# EAGLE design serial (EAGLE 5.04)
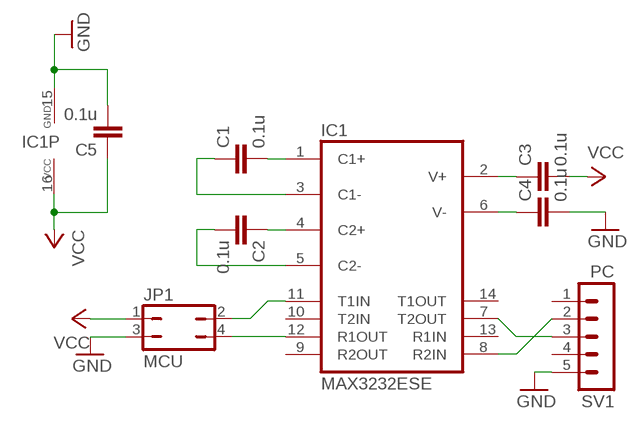
[diagram p0: schematic, sheet 1]

## Parts
C1  0.1u  C-EUC0805  [C0805]
C2  0.1u  C-EUC0805  [C0805]
C3  0.1u  C-EUC0805  [C0805]
C4  0.1u  C-EUC0805  [C0805]
C5  0.1u  C-EUC0805  [C0805]
IC1  MAX3232ESE  [SO16]
JP1  MCU  JP2Q  [JP2Q]
SV1  PC  MA05-1  [MA05-1]

## Nets
GND: C4.2 C5.2 IC1.15(GND) JP1.3 SV1.5
N$1: C1.2 IC1.1(C1+)
N$2: C2.1 IC1.4(C2+)
N$3: C3.1 IC1.2(V+)
N$4: C4.1 IC1.6(V-)
N$5: IC1.8(R2IN) SV1.2
N$6: C1.1 IC1.3(C1-)
N$7: C2.2 IC1.5(C2-)
N$8: IC1.7(T2OUT) SV1.3
N$9: IC1.12(R1OUT) JP1.4
N$10: IC1.11(T1IN) JP1.2
VCC: C3.2 C5.1 IC1.16(VCC) JP1.1
Unconnected: IC1.9(R2OUT) IC1.10(T2IN) IC1.13(R1IN) IC1.14(T1OUT) SV1.1 SV1.4

## Library data of the parts
C1-C5 = rcl:C-EU: CAPACITOR, European symbol
IC1 = maxim:MAX3232*: True RS-232 Transceivers 3.0V to 5.5V, Low-Power up to 1Mbps, Using Four 0.1µF External Capacitors Source: http://pdfserv.maxim-ic.com/en/ds/MAX3222-MAX3241.pdf
JP1 = jumper:JP2Q: JUMPER
SV1 = con-lstb:MA05-1: PIN HEADER

## Board
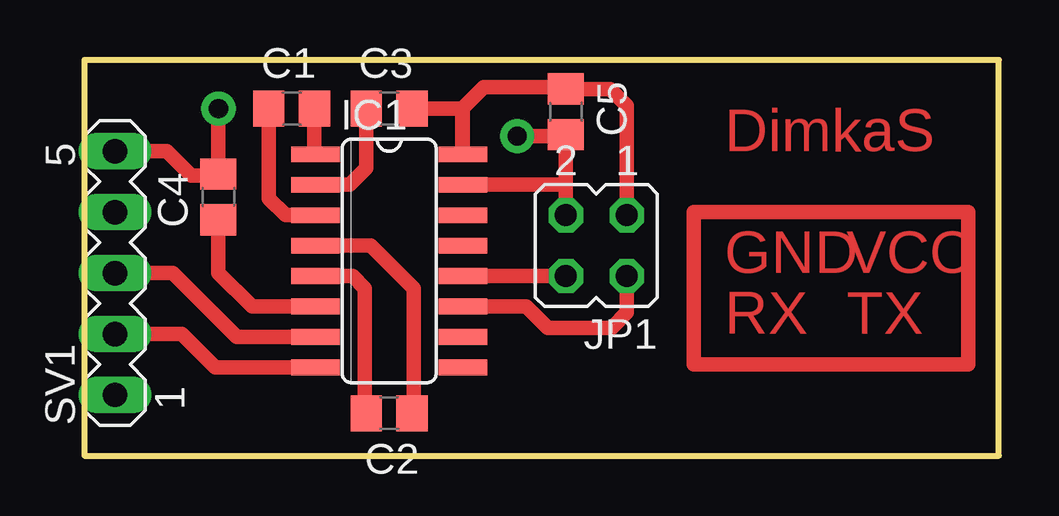
[diagram p1: board, top side]
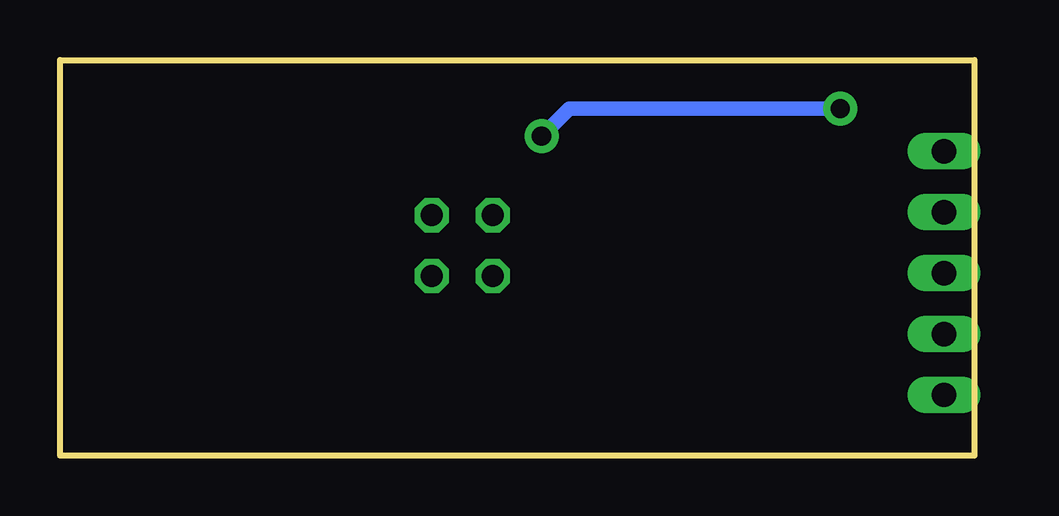
[diagram p2: board, bottom side, seen from below]

Size 38.1 x 16.51 mm. Coordinates in mm from the lower left corner, seen from the top.
Outline: 0,0 38.1,0 38.1,16.51 0,16.51 0,0
Copper layers (1*16): Top 0.035mm / dielectric 1.5mm / Bottom 0.035mm
Design rules "dimka": minimum track width 10mil, minimum drill 24mil, track to track 10mil, track to pad 10mil, pad to pad 10mil, via to via 10mil, smd to smd 10mil, copper to edge 40mil, drill to drill 10mil, minimum pad ring 10mil, minimum via ring 8mil, stop-mask expansion 4mil, vias tented up to drill 0mil, thermal gap 10mil

### Footprints (pad centres in the part's own frame; a part is rotated, then mirrored left to right if it is on the bottom)
C0805 = smd 1.3 x 1.5: 1 -0.95,0; 2 0.95,0
SO16 = smd 0.66 x 2.032: 1 -4.445,-3.073; 2 -3.175,-3.073; 3 -1.905,-3.073; 4 -0.635,-3.073; 5 0.635,-3.073; 6 1.905,-3.073; 7 3.175,-3.073; 8 4.445,-3.073; 9 4.445,3.073; 10 3.175,3.073; 11 1.905,3.073; 12 0.635,3.073; 13 -0.635,3.073; 14 -1.905,3.073; 15 -3.175,3.073; 16 -4.445,3.073
JP2Q = drill 0.914 octagon: 1 -1.27,-1.27; 2 -1.27,1.27; 3 1.27,-1.27; 4 1.27,1.27
MA05-1 = drill 1.016 long: 1 -5.08,0; 2 -2.54,0; 3 0,0; 4 2.54,0; 5 5.08,0

### Placement (x,y rotation side)
C1  8.64,14.48 0 top
C2  12.7,1.78 180 top
C3  12.7,14.48 0 top
C4  5.59,10.79 90 top
C5  20.07,14.35 270 top
IC1  12.7,8.13 270 top
JP1  21.34,8.76 180 top
SV1  1.27,7.62 90 top

### Tracks (layer width: path | path; a pad name or v marks a point on that pad's centre or on a via)
GND  (via drill 0.8 pad 1.42)
  Top 0.61: SV1.5 3.43,12.7 4.45,11.68 5.53,11.68 C4.2 v5.59,14.48 | IC1.15 20.07,11.3 20.07,10.79 | 20.07,10.79 JP1.3 | 20.07,10.79 C5.2 20,13.34 v18.03,13.34
  Bottom 0.61: v5.59,14.48 16.89,14.48 v18.03,13.34
N$1
  Top 0.61: C1.2 9.59,12.61 IC1.1
N$2
  Top 0.61: IC1.4 11.94,8.76 13.72,6.99 13.72,1.84 C2.1
N$3
  Top 0.61: C3.1 11.75,12 11.05,11.3 IC1.2
N$4
  Top 0.61: C4.1 5.59,7.62 6.99,6.22 IC1.6
N$5
  Top 0.61: SV1.2 4.06,5.08 5.46,3.68 IC1.8
N$6
  Top 0.61: C1.1 7.69,10.73 8.38,10.03 IC1.3
N$7
  Top 0.61: IC1.5 11.18,7.49 11.68,6.99 11.68,1.84 C2.2
N$8
  Top 0.61: SV1.3 3.68,7.62 6.35,4.95 IC1.7
N$9
  Top 0.61: IC1.12 JP1.4
N$10
  Top 0.61: IC1.11 18.41,6.22 19.3,5.33 21.97,5.33 22.61,5.97 JP1.2
N$11
  Top 0.61: 25.4,10.16 25.4,3.81 36.83,3.81 36.83,10.16 25.4,10.16
VCC
  Top 0.61: C3.2 15.75,14.48 | 15.75,14.48 15.75,12.6 IC1.16 15.77,14.45 15.75,14.48 | JP1.1 22.61,14.61 21.91,15.3 C5.1 20,15.37 16.64,15.37 15.75,14.48

### Text on the board
Top: DimkaS | GND | VCC | RX | TX